# Altium schematic sheet ADCIN_ACcoupled_ADT1-1WT.SchDoc
size A3
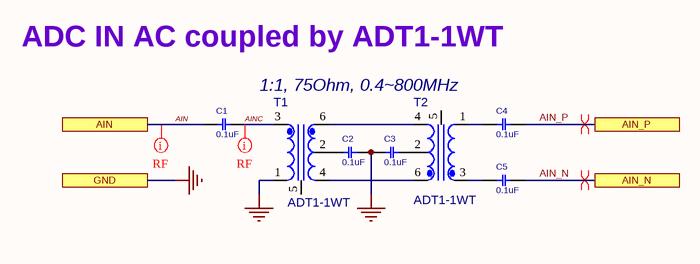
[diagram p0: ADCIN_ACcoupled_ADT1-1WT.SchDoc]

## Parts
C1  0.1uF  [C0402]
C2  0.1uF  [C0402]
C3  0.1uF  [C0402]
C4  0.1uF  [C0402]
C5  0.1uF  [C0402]
T1  ADT1-1WT  [TRNS254_6_8X6]
T2  ADT1-1WT  [TRNS254_6_8X6]

## Ports
AIN, AIN_N, AIN_P, GND

## Nets
GND: C2.2 C3.1 T1.1(PRI) ; port GND
AIN: C1.1 ; port AIN
AIN_N: C5.2 ; port AIN_N
AIN_P: C4.2 ; port AIN_P
AINC: C1.2 T1.3(PRI_DOT)
NetC2_1: C2.1 T1.2(SEC_CT)
NetC3_2: C3.2 T2.2(SEC_CT)
NetC4_1: C4.1 T2.1(PRI)
NetC5_1: C5.1 T2.3(PRI_DOT)
NetT1_4: T1.4(SEC) T2.6(SEC_DOT)
NetT1_6: T1.6(SEC_DOT) T2.4(SEC)

Not connected (* = marked no-connect by the designer): T1 5(NC); T2 5(NC)

## Layout directives
net class RF: AIN, AINC
differential pair: AIN_N, AIN_P

## Notes on the sheet
- ADC IN AC coupled by ADT1-1WT
- 1:1, 75Ohm, 0.4~800MHz
- Title
- Size:
- Date:
- A3
- Number:
- Time:
- Revision:
- Sheet
- of
- File:

## Library data of the parts
C1-C5 = CAP_SMD_MLCC_100n50TDK: CAP, MLCC, 100nF, 50V, X7R, 10%, 0402C; PARAM: X7R, 10%, -55~125oC; MANF_P#: GCM155R71H104KE02D; MANF: Murata; PARAM2: 50V; ASSEMBLY: ASSEMBLY; PRICE: 100= 4$; VALUE: 0.1uF
T1 T2 = ADT1-1WT: RF Transformer, 1:1, 75Ohm, 0.4~800MHz; MANF: Mini-Circuits; MANF_P#: ADT1-1WT, ADT1-1WT+; PARAM2: 0.5W, 30mA; PARAM: 75Ohm, 0.4~800MHz; VALUE: ADT1-1WT